# Altium schematic sheet PIC18F14K50.SchDoc
size A4
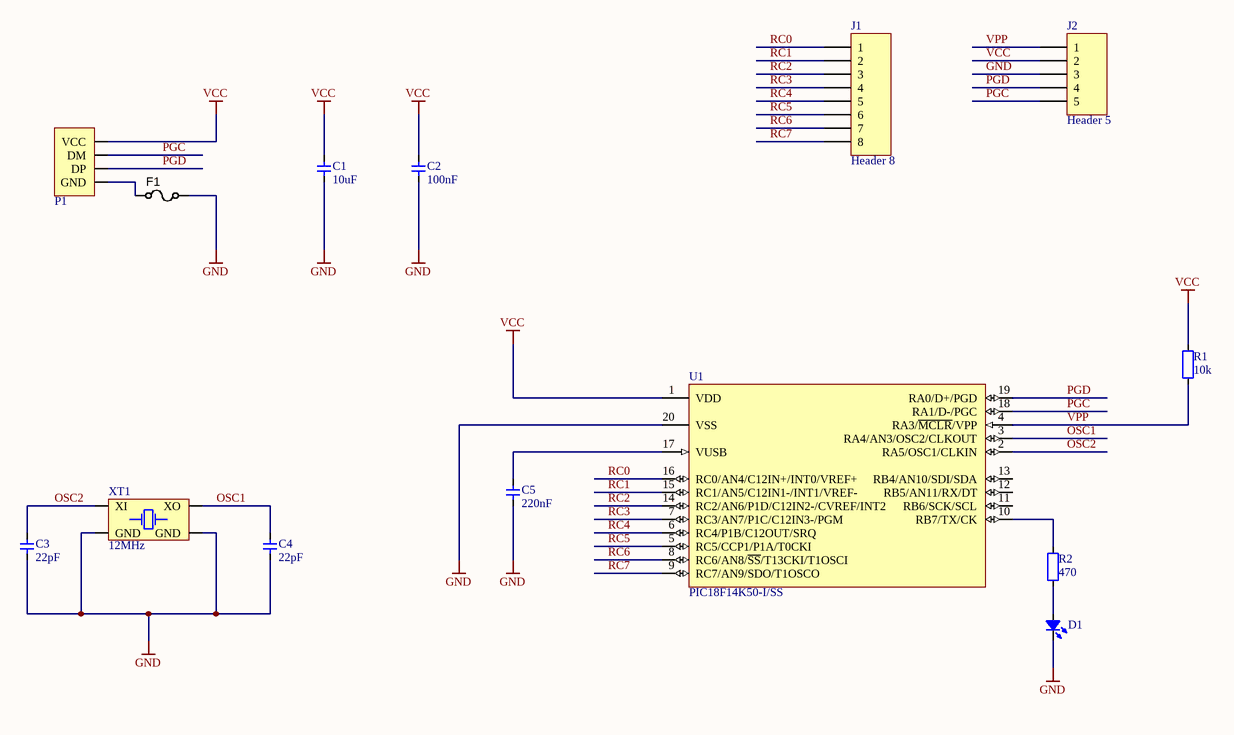
[diagram p0: PIC18F14K50.SchDoc]

## Parts
C1  value 10uF  [CAP_0603]  (hidden comment: Cap_0603)
C2  value 100nF  [CAP_0603]  (hidden comment: Cap_0603)
C3  value 22pF  [CAP_0603]  (hidden comment: Cap_0603)
C4  value 22pF  [CAP_0603]  (hidden comment: Cap_0603)
C5  value 220nF  [CAP_0603]  (hidden comment: Cap_0603)
D1  LED_0603  [LED_0603_RED]  (value not drawn)
F1  Slow-blow  [RESC3216X70N]  (value not drawn)
J1  Header 8  [HDR1X8]
J2  Header 5  [HDR1X5]
P1  USB_Plug_TypeA  [USB_Plug_TypeA]  (value not drawn)
R1  value 10k  [RES_0603]  (hidden comment: Res_0603)
R2  value 470  [RES_0603]  (hidden comment: Res_0603)
U1  PIC18F14K50-I/SS  [SSOP-SS20_N]
XT1  value 12MHz  [XT_2520_4]  (hidden comment: XTAL_2520_4P)

## Nets
GND: C1.1 C2.1 C3.1 C4.1 C5.1 D1.2(K) F1.2 J2.3 U1.20(VSS) XT1.2(GND) XT1.4(GND)
VCC: C1.2 C2.2 J2.2 P1.1(VCC) R1.2 U1.1(VDD)
OSC1: C4.2 U1.3(RA4/AN3/OSC2/CLKOUT) XT1.3(XO)
OSC2: C3.2 U1.2(RA5/OSC1/CLKIN) XT1.1(XI)
PGC: J2.5 P1.2(DM) U1.18(RA1/D-/PGC)
PGD: J2.4 P1.3(DP) U1.19(RA0/D+/PGD)
RC0: J1.1 U1.16(RC0/AN4/C12IN+/INT0/VREF+)
RC1: J1.2 U1.15(RC1/AN5/C12IN1-/INT1/VREF-)
RC2: J1.3 U1.14(RC2/AN6/P1D/C12IN2-/CVREF/INT2)
RC3: J1.4 U1.7(RC3/AN7/P1C/C12IN3-/PGM)
RC4: J1.5 U1.6(RC4/P1B/C12OUT/SRQ)
RC5: J1.6 U1.5(RC5/CCP1/P1A/T0CKI)
RC6: J1.7 U1.8(RC6/AN8/~{SS}/T13CKI/T1OSCI)
RC7: J1.8 U1.9(RC7/AN9/SDO/T1OSCO)
VPP: J2.1 R1.1 U1.4(RA3/~{MCLR}/VPP)
NetC5_2: C5.2 U1.17(VUSB)
NetD1_1: D1.1(A) R2.1
NetF1_1: F1.1 P1.4(GND)
NetR2_2: R2.2 U1.10(RB7/TX/CK)

Not connected (* = marked no-connect by the designer): U1 11(RB6/SCK/SCL) 12(RB5/AN11/RX/DT) 13(RB4/AN10/SDI/SDA)

## Library data of the parts
C1-C5 = Cap_0603: Capacitor
D1 = LED_0603: LED
F1 = FUSE_160mA_1206: Fuse 750mA 6VDC 1206 SMD; Manufacturer 1: TE Connectivity; Manufacturer Part Number 1: NANOSMDC075F-2; Ratings: 750mA; 6VDC; slow-blow; SCDType: spec; Package / Case: 1206 (3216 metric); Value: 750mA
J1 = Header 8: Header, 8-Pin; LatestRevisionDate: 17-Jul-2002; LatestRevisionNote: Re-released for DXP Platform.; Publisher: Altium Limited
J2 = Header 5: Header, 5-Pin; LatestRevisionDate: 17-Jul-2002; LatestRevisionNote: Re-released for DXP Platform.; Publisher: Altium Limited
P1 = USB_Plug_TypeA: USB
R1 R2 = Res_0603: Resistor
U1 = PIC18F14K50-I/SS: USB Flash Microcontroller with nanoWatt XLP Technology, 20-pin SSOP, Industrial Temperature; Published: 2-Dec-2009; DatasheetVersion: revC, Mar-2009; PackageVersion: revBB, Aug-2009; PackageReference: SSOP-SS20; Publisher: Altium Limited; PackageDescription: 20-Lead Plastic Shrink Small Outline (SS) - 5.3mm Body [SSOP]; Supplier 1: Digi-Key; Supplier Part Number 1: PIC18F14K50-I/SS-ND; Supplier 2: Farnell; Supplier Part Number 2: 1648504; Code_JEDEC: MO-150; Code_IPC: SOP65P780-20; ComponentLink1Description: Datasheet; ComponentLink1URL: http://ww1.microchip.com/downloads/en/DeviceDoc/41350C.pdf; ComponentLink2Description: Packaging Specification; ComponentLink2URL: http://www.microchip.com/stellent/groups/techpub_sg/documents/packagingspec/en012702.pdf; ComponentLink3Description: Microchip.com Home; ComponentLink3URL: http://www.microchip.com/
XT1 = XTAL_2520_4P: Crystal Oscillator